# EasyEDA Pro project OpenHaldexC6-V1.1_2026-01-01.epro, board Haldex C6 V1.0
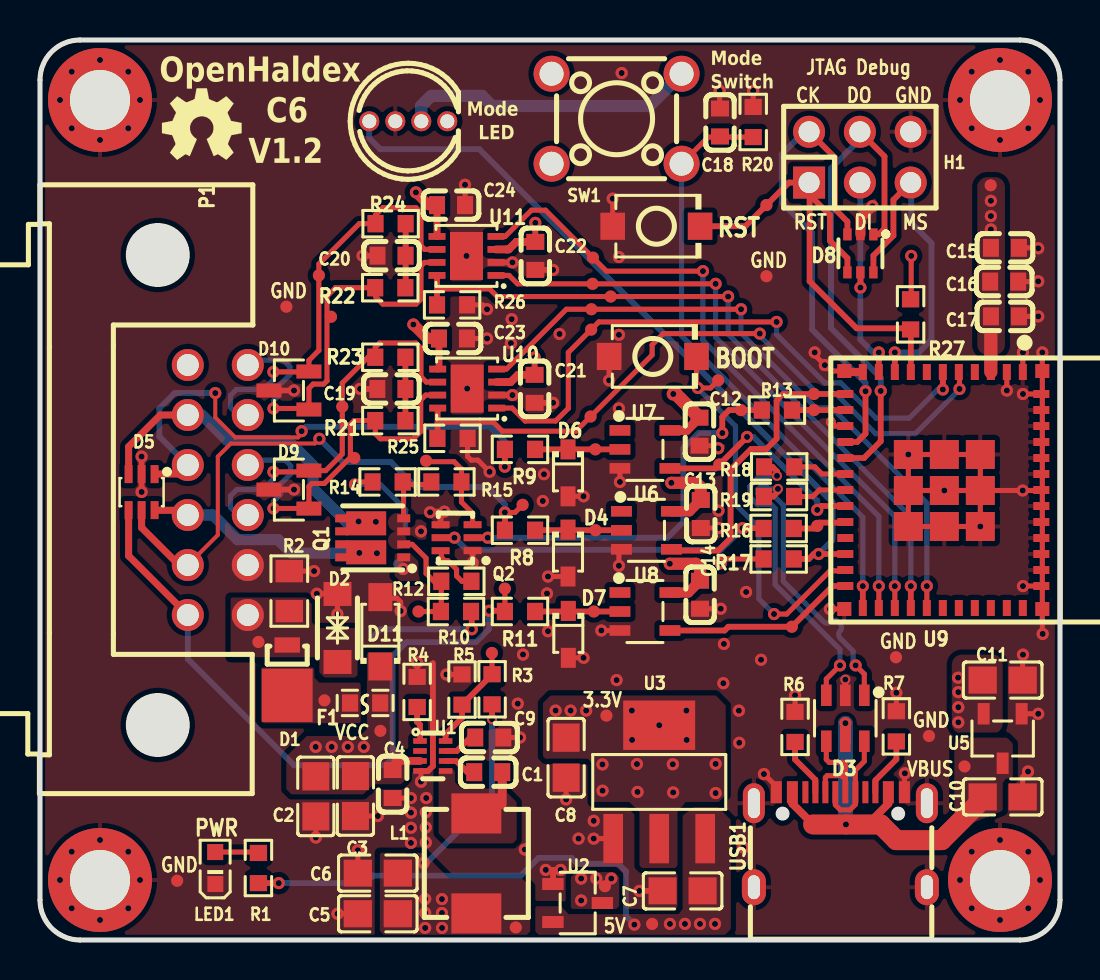
[diagram p3: board, top side]
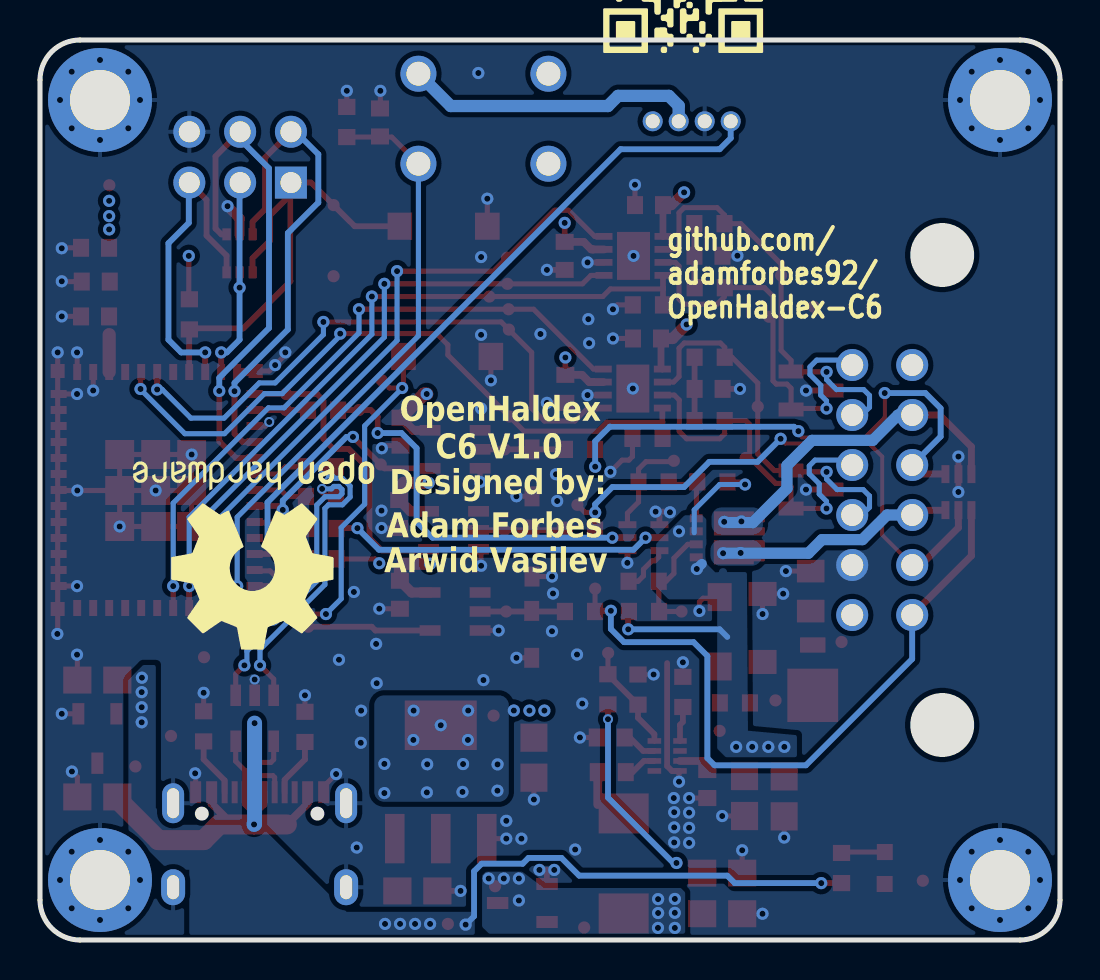
[diagram p4: board, bottom side, seen from below]

Outline 51 x 45 mm; copper layers: Top Layer, PWR, GND, Bottom Layer. Coordinates in mm from the lower left corner of the outline.
Outline path: 0,43 0,2 arc(0.59,0.59) 2,0 49,0 arc(50.41,0.59) 51,2 51,43 arc(50.41,44.41) 49,45 2,45 arc(0.59,44.41) 0,43
Stack: Top Layer 0.035mm Outer layer thickness 1oz / Dielectric1 0.2104mm 7628 RC49% 8.6mil / PWR 0.0152mm Inner layer thickness / Dielectric2 1.065mm 1.1mm H/HOZ Copper / GND 0.0152mm Inner layer thickness / Dielectric3 0.2104mm 7628 RC49% 8.6mil / Bottom Layer 0.035mm Outer layer thickness 1oz

## Design rules (mm)
net USB_D-: DP5
net USB_D+: DP5
net CHASSIS_CANL: DP1
net CHASSIS_CANH: DP1
net HALDEX_CANL: DP2
net HALDEX_CANH: DP2
net ESP_USB_D-: DP7
net ESP_USB_D+: DP7
net D-: DP6
net D+: DP6
template: Custom Config
spacing copperThickness1oz (default): track to track 0.102, other pairs 0.152 to 0.3
spacing copperThickness2oz: track to track 0.203, other pairs 0.152 to 0.3
track width copperThickness1oz: min 0.127, default 0.254, max 2.54
track width copperThickness2oz (default): min 0.127, default 0.254, max 2.54
differential pair differentialPair (default): width min 0.127, default 0.254, max 2.54; gap min 0.152, default 0.152
via viaSize (default): diameter min 0.5, default 0.61, max 10; hole min 0.3, default 0.305, max 6.3

## Placement (name value [footprint] x y rotation side)
C1  100nF  [C0603]  22.41 8.39 180 top
C2  22uF  [C0805]  13.79 7.18 270 top
C3  22uF  [C0805]  15.77 7.2 270 top
C4  100nF  [C0603]  17.64 7.8 90 top
C5  47uF  [C0805]  16.89 1.31 0 top
C6  47uF  [C0805]  16.89 3.34 0 top
C7  22uF  [C0805]  32.13 2.45 0 top
C8  47uF  [C0805]  26.31 9.12 90 top
C9  33nF  [C0603]  22.46 10.13 180 top
C10  22uF  [C0805]  48.13 7.15 0 top
C11  22uF  [C0805]  48.13 13 0 top
C12  100nF  [C0603]  32.97 25.42 90 top
C13  100nF  [C0603]  33.04 21.3 90 top
C14  100nF  [C0603]  33 17.26 90 top
C15  4.7uF  [C0603]  48.25 34.61 0 top
C16  2.2uF  [C0603]  48.21 32.92 0 top
C17  100nF  [C0603]  48.25 31.18 0 top
C18  1uF  [C0603]  34 40.88 90 top
C19  2.2nF  [C0603]  17.57 27.55 0 top
C20  2.2nF  [C0603]  17.58 34.21 0 top
C21  100nF  [C0603]  24.73 27.56 90 top
C22  100nF  [C0603]  24.76 34.2 90 top
C23  1uF  [C0603]  20.65 30.08 0 top
C24  1uF  [C0603]  20.55 36.75 0 top
D1  SS3P3-M3/84A  [DO-220AA_L3.4-W2.0-LS3.9-RD]  12.36 13.49 90 top
D2  SMF24CA  [SOD-123FL_L2.8-W1.8-LS3.7-BI]  14.87 15.6 270 top
D3  USBLC6-2SC6  [SOT-23-6_L2.9-W1.6-P0.95-LS2.8-BL]  40.27 11.09 180 top
D4  BZT52C4V7S  [SOD-323_L1.8-W1.3-LS2.5-RD]  26.4 19.35 270 top
D5  SMF12CT1G  [SOT-363_L2.0-W1.3-P0.65-LS2.1-BR]  5.08 22.39 90 top
D6  BZT52C4V7S  [SOD-323_L1.8-W1.3-LS2.5-RD]  26.4 23.36 270 top
D7  BZT52C4V7S  [SOD-323_L1.8-W1.3-LS2.5-RD]  26.42 15.28 270 top
D8  SMF05C  [SC-70-6_L2.0-W1.3-P0.65-LS2.1-BR]  41.02 34.33 90 top
D9  PESD2CAN  [SOT-23-3_L2.9-W1.3-P1.90-LS2.4-BR]  12.45 22.52 0 top
D10  PESD2CAN  [SOT-23-3_L2.9-W1.3-P1.90-LS2.4-BR]  12.45 27.47 0 top
D11  SMF24A  [SOD-123FL_L2.7-W1.8-LS3.8-RD]  17.02 15.41 90 top
F1  0467001.NRHF  [F0603]  16.26 11.85 0 top
H1  2.54-2*3  [HDR-TH_6P-P2.54-V-R2-C3-S2.54_A2541WV-2X3P]  40.99 39.14 0 top
L1  3.3uH  [IND-SMD_L5.4-W5.2_RS0530]  21.82 3.83 270 top
LED1  XL-1608UGC-04  [LED0603-RD_GREEN]  8.76 3.6 90 top
LED2  WS2812D-F5  [LED-TH_4P-BD5.8-P1.30]  18.41 40.94 0 top
NOREF  -  [Pad_e3430]  27.56 30.52 0 top
NOREF#2  -  [Pad_e6813]  38.86 20.7 0 top
NOREF#3  -  [Pad_e6564]  24.13 21.76 0 top
NOREF#4  -  [Pad_e7535]  47.53 37.74 0 top
NOREF#5  -  [Pad_e6325]  23.24 17.57 0 top
NOREF#6  -  [Pad_e5614]  19.31 23.96 0 top
NOREF#7  -  [Pad_e190]  48 42 90 top
NOREF#8  -  [Pad_e3424]  27.57 31.54 0 top
NOREF#9  -  [Pad_e4156]  27.77 24.53 0 top
NOREF#10  -  [Pad_e7773]  22.59 14.35 0 top
NOREF#11  -  [Pad_e4150]  27.78 20.49 0 top
NOREF#12  -  [Pad_e188]  3 42 90 top
NOREF#13  -  [Pad_e3909]  27.53 26.17 0 top
NOREF#14  -  [Pad_e835]  10.92 14.9 0 top
NOREF#15  -  [Pad_e2628]  23.79 0.63 0 top
NOREF#16  -  [Pad_e5126]  15.11 26.67 0 top
NOREF#17  -  [Pad_e833]  14.22 11.98 0 top
NOREF#18  -  [Pad_e5133]  15.71 24.1 0 top
NOREF#19  -  [Pad_e2329]  44.45 10.2 0 top
NOREF#20  -  [Pad_e3406]  27.65 34.12 0 top
NOREF#21  -  [Pad_e6811]  33.96 23.78 0 top
NOREF#22  -  [Pad_e5375]  14.55 31.16 0 top
NOREF#23  -  [Pad_e830]  28.25 2.69 0 top
NOREF#24  -  [Pad_e6815]  37.59 15.66 0 top
NOREF#25  -  [Pad_e832]  17.02 10.46 0 top
NOREF#26  -  [Pad_e191]  48 3 90 top
NOREF#27  -  [Pad_e2333]  42.8 14.14 0 top
NOREF#28  -  [Pad_e826]  46.23 8.68 0 top
NOREF#29  -  [Pad_e3418]  28.53 32.17 0 top
NOREF#30  -  [Pad_e3412]  27.63 32.81 0 top
NOREF#31  -  [Pad_e2331]  12.32 31.67 0 top
NOREF#32  -  [Pad_e6804]  38.7 26.5 0 top
NOREF#33  -  [Pad_e5852]  18.92 16.42 0 top
NOREF#34  -  [Pad_e6819]  33.91 27.98 0 top
NOREF#35  -  [Pad_e2340]  6.86 2.96 0 top
NOREF#36  -  [Pad_e2338]  36.32 33.19 0 top
NOREF#37  -  [Pad_e875]  28.32 11.22 0 top
NOREF#38  -  [Pad_e5369]  13.94 33.23 0 top
NOREF#39  -  [Pad_e837]  30.61 0.8 0 top
NOREF#40  -  [Pad_e4162]  27.69 16.42 0 top
NOREF#41  -  [Pad_e8960]  35.05 26.5 0 top
NOREF#42  -  [Pad_e192]  3 3 90 top
NOREF#43  -  [Pad_e6801]  38.69 27.3 0 top
NOREF#44  -  [Pad_e7058]  36.32 36.75 0 top
P1  MX23A12NF1  [COON-TH_MX23A12NF1]  8.89 22.5 270 top
Q1  AGM30P14MBP  [DFN-8_L3.2-W3.1-P0.65-LS3.4-BL-1]  16.64 20.11 90 top
Q2  2N7002DW  [SOT-363-6_L2.0-W1.3-P0.65-LS2.1-BL]  20.83 20.11 90 top
R1  1kΩ  [R0603]  10.92 3.6 270 top
R2  280pF@1MHz  [R0805]  12.47 17.45 270 top
R3  52.3kΩ  [R0603]  22.6 12.53 270 top
R4  20kΩ  [R0603]  18.86 12.4 270 top
R5  10kΩ  [R0603]  21.1 12.52 270 top
R6  5.1kΩ  [R0603]  37.75 10.65 270 top
R7  5.1kΩ  [R0603]  42.82 10.68 270 top
R8  1kΩ  [R0603]  24 20.49 180 top
R9  1kΩ  [R0603]  24 24.53 180 top
R10  20kΩ  [R0603]  20.8 16.42 0 top
R11  1kΩ  [R0603]  24 16.42 180 top
R12  10kΩ  [R0603]  20.82 17.94 180 top
R13  1kΩ  [R0603]  36.85 26.5 180 top
R14  20kΩ  [R0603]  17.38 22.9 180 top
R15  10kΩ  [R0603]  20.32 22.9 0 top
R16  1kΩ  [R0603]  36.93 20.58 180 top
R17  10kΩ  [R0603]  36.93 19.05 180 top
R18  33Ω  [R0603]  36.96 23.66 0 top
R19  33Ω  [R0603]  36.95 22.17 0 top
R20  10kΩ  [R0603]  35.66 40.9 270 top
R21  60.4Ω  [R0603]  17.52 25.97 180 top
R22  60.4Ω  [R0603]  17.51 32.61 180 top
R23  60.4Ω  [R0603]  17.52 29.14 0 top
R24  60.4Ω  [R0603]  17.53 35.82 0 top
R25  10kΩ  [R0603]  20.62 25.08 0 top
R26  10kΩ  [R0603]  20.61 31.76 0 top
R27  10kΩ  [R0603]  43.53 31.28 90 top
SW1  TS-1002-07026  [SW-TH_4P-L6.0-W6.0-P4.50-LS6.5]  28.83 41.06 0 top
SW2  TS-1088-AR02016  [SW-SMD_L3.9-W3.0-P4.45]  30.82 35.69 0 top
SW3  TS-1088-AR02016  [SW-SMD_L3.9-W3.0-P4.45]  30.64 29.18 0 top
U1  TPS62933DRLR  [SOT-583-8_L2.1-W1.2-P0.50-LS1.6-BR]  19.64 9.2 180 top
U2  CH213K  [SOT-23-3_L2.9-W1.6-P1.90-LS2.8-BR]  26.88 1.85 180 top
U3  AMS1117-3.3  [SOT-223-4_L6.5-W3.5-P2.30-LS7.0-BR]  30.96 7.9 270 top
U5  CH213K  [SOT-23-3_L2.9-W1.6-P1.90-LS2.8-BR]  48.13 10.08 90 top
U6  SN74LVC1G17DBVR  [SOT-23-5_L3.0-W1.5-P0.95-LS2.8-BL]  30.32 20.48 270 top
U7  SN74LVC1G17DBVR  [SOT-23-5_L3.0-W1.5-P0.95-LS2.8-BL]  30.25 24.53 270 top
U8  SN74LVC1G17DBVR  [SOT-23-5_L3.0-W1.5-P0.95-LS2.8-BL]  30.25 16.42 270 top
U9  ESP32-C6-MINI-1-N4  [WIFIM-SMD_61P-L16.6-W13.2-P0.80-ESP32-C6-MINI-1-N4]  45.17 22.5 270 top
U10  TCAN1044VDRBRQ1  [VSON-8_L3.0-W3.0-P0.65-BR-EP]  21.36 27.57 0 top
U11  TCAN1044VDRBRQ1  [VSON-8_L3.0-W3.0-P0.65-BR-EP]  21.32 34.2 0 top
USB1  TYPE-C 16PIN 2MD(073)  [USB-C-SMD_TYPE-C-6PIN-2MD-073]  40.02 5.01 0 top

## Footprints (pads in the part's own frame, mm; a bottom-side part is the same pattern mirrored in y, then rotated)
C0603
  rect 0.8x0.9 smd: 1(-0.7,0) 2(0.7,0)
C0805
  rect 1.41x1.35 smd: 1(-1,0) 2(1,0)
COON-TH_MX23A12NF1
  round 1.6 hole 1.1: 1(6.25,1.5) 2(3.75,1.5) 3(1.25,1.5) 4(-1.25,1.5) 5(-3.75,1.5) 6(-6.25,1.5) 7(6.25,-1.5) 8(3.75,-1.5) 9(1.25,-1.5) 10(-1.25,-1.5) 11(-3.75,-1.5) 12(-6.25,-1.5)
DFN-8_L3.2-W3.1-P0.65-LS3.4-BL-1
  rect 0.4x0.65 smd: 1(-0.975,-1.55) 2(-0.325,-1.55) 3(0.325,-1.55) 4(0.975,-1.55) 5(0.975,1.55) 6(0.325,1.55) 7(-0.325,1.55) 8(-0.975,1.55)
  rect 1.2x2 smd: 6(0.725,0.329) 8(-0.725,0.326)
DO-220AA_L3.4-W2.0-LS3.9-RD
  rect 2.67x2.54 smd: 1(-1.258,0)
  rect 0.762x1.27 smd: 2(1.258,0)
F0603
  rect 0.806x0.864 smd: 1(-0.753,0) 2(0.753,0)
HDR-TH_6P-P2.54-V-R2-C3-S2.54_A2541WV-2X3P
  rect 1.6x1.6 hole 1.05: 1(-2.54,-1.27)
  round 1.6 hole 1.05: 2(-2.54,1.27) 3(0,-1.27) 4(0,1.27) 5(2.54,-1.27) 6(2.54,1.27)
IND-SMD_L5.4-W5.2_RS0530
  rect 2x2.5 smd: 1(-2.5,0) 2(2.5,0)
LED0603-RD_GREEN
  rect 0.8x0.8 smd: 1(-0.799,-0.004) 2(0.799,0.004)
LED-TH_4P-BD5.8-P1.30
  round 1 hole 0.7: 1(1.95,0) 2(0.65,0) 3(-0.65,0) 4(-1.95,0)
Pad_e188
  round 5.2 hole 3: 1(0,0)
Pad_e190
  round 5.2 hole 3: 1(0,0)
Pad_e191
  round 5.2 hole 3: 1(0,0)
Pad_e192
  round 5.2 hole 3: 1(0,0)
Pad_e826
  round 0.61 smd: TP1(0,0)
Pad_e830
  round 0.61 smd: TP3(0,0)
Pad_e832
  round 0.61 smd: TP4(0,0)
Pad_e833
  round 0.61 smd: TP5(0,0)
Pad_e835
  round 0.61 smd: TP6(0,0)
Pad_e837
  round 0.61 smd: TP7(0,0)
Pad_e875
  round 0.61 smd: TP8(0,0)
Pad_e2329
  round 0.61 smd: TP1(0,0)
Pad_e2331
  round 0.61 smd: TP1(0,0)
Pad_e2333
  round 0.61 smd: TP1(0,0)
Pad_e2338
  round 0.61 smd: TP1(0,0)
Pad_e2340
  round 0.61 smd: TP1(0,0)
Pad_e2628
  round 0.61 smd: TP7(0,0)
Pad_e3406
  round 0.61 smd: TP1(0,0)
Pad_e3412
  round 0.61 smd: TP2(0,0)
Pad_e3418
  round 0.61 smd: TP3(0,0)
Pad_e3424
  round 0.61 smd: TP4(0,0)
Pad_e3430
  round 0.61 smd: TP5(0,0)
Pad_e3909
  round 0.61 smd: TP6(0,0)
Pad_e4150
  round 0.61 smd: TP7(0,0)
Pad_e4156
  round 0.61 smd: TP8(0,0)
Pad_e4162
  round 0.61 smd: TP9(0,0)
Pad_e5126
  round 0.61 smd: TP11(0,0)
Pad_e5133
  round 0.61 smd: TP12(0,0)
Pad_e5369
  round 0.61 smd: TP13(0,0)
Pad_e5375
  round 0.61 smd: TP14(0,0)
Pad_e5614
  round 0.61 smd: TP15(0,0)
Pad_e5852
  round 0.61 smd: TP16(0,0)
Pad_e6325
  round 0.61 smd: TP17(0,0)
Pad_e6564
  round 0.61 smd: TP18(0,0)
Pad_e6801
  round 0.61 smd: TP19(0,0)
Pad_e6804
  round 0.61 smd: TP20(0,0)
Pad_e6811
  round 0.61 smd: TP21(0,0)
Pad_e6813
  round 0.61 smd: TP22(0,0)
Pad_e6815
  round 0.61 smd: TP23(0,0)
Pad_e6819
  round 0.61 smd: TP24(0,0)
Pad_e7058
  round 0.61 smd: TP25(0,0)
Pad_e7535
  round 0.61 smd: TP26(0,0)
Pad_e7773
  round 0.61 smd: TP27(0,0)
Pad_e8960
  round 0.61 smd: TP28(0,0)
R0603
  rect 0.806x0.864 smd: 1(-0.753,0) 2(0.753,0)
R0805
  rect 1.133x1.377 smd: 1(-1,0) 2(1,0)
SC-70-6_L2.0-W1.3-P0.65-LS2.1-BR
  rect 0.6x0.42 smd: 1(0.95,-0.65) 2(0.95,0) 3(0.95,0.65) 4(-0.95,0.65) 5(-0.95,0) 6(-0.95,-0.65)
SOD-123FL_L2.7-W1.8-LS3.8-RD
  rect 1.4x1.2 smd: 1(-1.735,0) 2(1.735,0)
SOD-123FL_L2.8-W1.8-LS3.7-BI
  rect 1.2x1.4 smd: 1(-1.7,0) 2(1.7,0)
SOD-323_L1.8-W1.3-LS2.5-RD
  rect 1x0.75 smd: 1(-1.173,0) 2(1.173,0)
SOT-23-3_L2.9-W1.3-P1.90-LS2.4-BR
  rect 1.25x0.7 smd: 1(1,-0.95) 2(1,0.95) 3(-1,0)
SOT-23-3_L2.9-W1.6-P1.90-LS2.8-BR
  rect 1.07x0.6 smd: 1(1.235,-0.95) 2(1.235,0.95) 3(-1.235,0)
SOT-23-5_L3.0-W1.5-P0.95-LS2.8-BL
  rect 0.532x1.045 smd: 1(-0.95,-1.25) 2(0,-1.25) 3(0.95,-1.25) 4(0.95,1.25) 5(-0.95,1.25)
SOT-23-6_L2.9-W1.6-P0.95-LS2.8-BL
  rect 0.532x1.072 smd: 1(-0.95,-1.149) 2(0,-1.149) 3(0.95,-1.149) 4(0.95,1.149) 5(0,1.149) 6(-0.95,1.149)
SOT-223-4_L6.5-W3.5-P2.30-LS7.0-BR
  rect 2.47x0.98 smd: 1(2.835,-2.3) 2(2.835,0) 3(2.835,2.3)
  rect 2.47x3.6 smd: 4(-2.835,0)
SOT-363-6_L2.0-W1.3-P0.65-LS2.1-BL
  rect 0.35x0.9 smd: 1(-0.65,-0.8) 2(0,-0.8) 3(0.65,-0.8) 4(0.65,0.8) 5(0,0.8) 6(-0.65,0.8)
SOT-363_L2.0-W1.3-P0.65-LS2.1-BR
  rect 0.9x0.4 smd: 1(0.9,-0.65) 2(0.9,0) 3(0.9,0.65) 4(-0.9,0.65) 5(-0.9,0) 6(-0.9,-0.65)
SOT-583-8_L2.1-W1.2-P0.50-LS1.6-BR
  rect 0.68x0.28 smd: 1(0.64,-0.75) 2(0.64,-0.25) 3(0.64,0.25) 4(0.64,0.75) 5(-0.64,0.75) 6(-0.64,0.25) 7(-0.64,-0.25) 8(-0.64,-0.75)
SW-SMD_L3.9-W3.0-P4.45
  rect 1.23x1.36 smd: 1(-2.185,0) 2(2.185,0)
SW-TH_4P-L6.0-W6.0-P4.50-LS6.5
  round 1.8 hole 1.2: 1(-3.25,2.25) 2(3.25,2.25) 3(-3.25,-2.25) 4(3.25,-2.25)
USB-C-SMD_TYPE-C-6PIN-2MD-073
  rect 0.55x1.1 smd: 1(-3.2,2.375) 2(-2.4,2.375) 11(2.4,2.375) 12(3.2,2.375)
  rect 0.3x1.1 smd: 3(-1.75,2.375) 4(-1.25,2.375) 5(-0.75,2.375) 6(-0.25,2.375) 7(0.25,2.375) 8(0.75,2.375) 9(1.25,2.375) 10(1.75,2.375)
  oval 1.1x2 hole 0.6x1.5: 13(-4.325,1.825) 14(4.325,1.825)
  oval 1.2x1.8 hole 0.6x1.2: 13(-4.325,-2.375) 14(4.325,-2.375)
VSON-8_L3.0-W3.0-P0.65-BR-EP
  rect 0.85x0.34 smd: 1(1.476,-0.976) 2(1.476,-0.325) 3(1.476,0.325) 4(1.476,0.976) 5(-1.476,0.976) 6(-1.476,0.325) 7(-1.476,-0.325) 8(-1.476,-0.976)
  rect 1.65x2.4 smd: 9(0,0)
WIFIM-SMD_61P-L16.6-W13.2-P0.80-ESP32-C6-MINI-1-N4
  rect 0.8x0.4 smd: 1(-5.9,3.975) 2(-5.9,3.175) 3(-5.9,2.375) 4(-5.9,1.575) 5(-5.9,0.775) 6(-5.9,-0.025) 7(-5.9,-0.825) 8(-5.9,-1.625) 9(-5.9,-2.425) 10(-5.9,-3.225) 11(-5.9,-4.025) 25(5.9,-4.025) 26(5.9,-3.225) 27(5.9,-2.425) 28(5.9,-1.625) 29(5.9,-0.825) 30(5.9,-0.025) 31(5.9,0.775) 32(5.9,1.575) 33(5.9,2.375) 34(5.9,3.175) 35(5.9,3.975)
  rect 0.4x0.8 smd: 12(-4.8,-4.9) 13(-4,-4.9) 14(-3.2,-4.9) 15(-2.4,-4.9) 16(-1.6,-4.9) 17(-0.8,-4.9) 18(0,-4.9) 19(0.8,-4.9) 20(1.6,-4.9) 21(2.4,-4.9) 22(3.2,-4.9) 23(4,-4.9) 24(4.8,-4.9) 36(4.8,4.9) 37(4,4.9) 38(3.2,4.9) 39(2.4,4.9) 40(1.6,4.9) 41(0.8,4.9) 42(0,4.9) 43(-0.8,4.9) 44(-1.6,4.9) 45(-2.4,4.9) 46(-3.2,4.9) 47(-4,4.9) 48(-4.8,4.9)
  rect 1.45x1.45 smd: 49(-1.775,1.85) 49(-1.775,0.05) 49(-1.775,-1.75) 49(0.025,1.85) 49(0.025,0.05) 49(0.025,-1.75) 49(1.825,1.85) 49(1.825,0.05) 49(1.825,-1.75)
  rect 0.7x0.7 smd: 50(5.95,4.95) 51(5.95,-4.95) 52(-5.95,-4.95) 53(-5.95,4.95)

## Nets
+3.3V: C8.2 C12.2 C13.2 C14.2 C15.1 C16.1 C17.1 C23.1 C24.1 LED2.2 NOREF#4.TP26 NOREF#37.TP8 R17.2 R27.2 SW1.2 U3.2 U3.4 U6.5 U7.5 U8.5 U9.3 U10.5 U11.5
+5V: C7.2 C11.1 C21.2 C22.2 NOREF#39.TP7 R1.2 U2.2 U3.3 U5.2 U10.3 U11.3
GND: C2.2 C3.2 C4.1 C5.1 C6.1 C7.1 C8.1 C9.1 C10.2 C11.2 C12.1 C13.1 C14.1 C15.2 C16.2 C17.2 C18.2 C19.1 C20.1 C21.1 C22.1 C23.2 C24.2 D2.1 D3.2 D4.2 D5.2 D6.2 D7.2 D8.2 D9.3 D10.3 D11.2 H1.6 LED1.1 LED2.3 NOREF#7.1 NOREF#12.1 NOREF#19.TP1 NOREF#26.1 NOREF#27.TP1 NOREF#31.TP1 NOREF#35.TP1 NOREF#36.TP1 NOREF#42.1 P1.2 Q2.1 Q2.4 R2.1 R4.1 R5.1 R6.1 R7.1 R20.1 R25.2 R26.2 SW2.1 SW3.1 U1.4 U2.1 U3.1 U5.1 U6.3 U7.3 U8.3 U9.1 U9.2 U9.11 U9.14 U9.36 U9.37 U9.38 U9.39 U9.40 U9.41 U9.42 U9.43 U9.44 U9.45 U9.46 U9.47 U9.48 U9.49 U9.50 U9.51 U9.52 U9.53 U10.2 U10.9 U11.2 U11.9 USB1.1 USB1.12 USB1.13 USB1.14
VBAT: D1.2 D2.2 NOREF#14.TP6 P1.1 R2.2
VBAT_UF: D1.1 F1.1 NOREF#17.TP5
VBUS: C10.1 D3.5 NOREF#28.TP1 U5.3 USB1.2 USB1.11
VCC: C2.1 C3.1 C4.2 D11.1 F1.2 NOREF#25.TP4 Q1.1 Q1.3 R10.2 R14.2 U1.3
BOOT: NOREF#34.TP24 SW3.2 U9.23
BRAKE_IN: D5.5 NOREF#3.TP18 P1.8 R8.2
BRAKE_OUT: D5.6 P1.9 Q1.7 Q1.8
BST: C1.2 U1.6
BUCK_OUT: C5.2 C6.2 L1.2 NOREF#15.TP7 NOREF#23.TP3 R3.2 U2.3
CAN0_RX: NOREF#8.TP4 U9.29 U10.4
CAN0_STANDBY: NOREF#13.TP6 R25.1 U9.5 U10.8
CAN0_TX: NOREF.TP5 U9.6 U10.1
CAN1_RX: NOREF#20.TP1 U9.26 U11.4
CAN1_STANDBY: NOREF#29.TP3 R26.1 U9.28 U11.8
CAN1_TX: NOREF#30.TP2 U9.27 U11.1
CC1: R6.2 USB1.4
CC2: R7.2 USB1.10
CHASSIS_CANH: D9.1 NOREF#18.TP12 P1.4 R21.2 U10.7
CHASSIS_CANL: D9.2 NOREF#16.TP11 P1.3 R23.1 U10.6
D+: R19.2 U9.18
D-: R18.2 U9.17
EN_TPS: U1.2
ESP_BRAKE_IN: NOREF#43.TP19 U6.4 U9.12
ESP_BRAKE_OUT: NOREF#32.TP20 R13.1 U9.13
ESP_BRAKE_TRANS: NOREF#41.TP28 Q2.2 R13.2
ESP_HB_IN: NOREF#21.TP21 U7.4 U9.19
ESP_HB_OUT: NOREF#2.TP22 R16.1 U9.20
ESP_HB_TRANS: Q2.5 R16.2
ESP_SWITCH_MODE_EXT: NOREF#24.TP23 U8.4 U9.24
ESP_USB_D+: D3.1 R19.1
ESP_USB_D-: D3.3 R18.1
FB: NOREF#10.TP27 R3.1 R5.2 U1.8
HALDEX_CANH: D10.1 NOREF#22.TP14 P1.6 R22.2 U11.7
HALDEX_CANL: D10.2 NOREF#38.TP13 P1.5 R24.1 U11.6
HB_IN: D5.1 P1.10 R9.2
HB_OUT: D5.3 P1.11 Q1.5 Q1.6
MTCK: D8.3 H1.2 U9.15
MTDI: D8.5 H1.3 U9.10
MTDO: D8.1 H1.4 U9.16
MTMS: D8.6 H1.5 U9.9
RESET: D8.4 H1.1 NOREF#44.TP25 R27.1 SW2.2 U9.8
RGB_LED: LED2.4 R17.1 U9.22
RT: R4.2 U1.1
SS: C9.2 U1.7
SW: C1.1 L1.1 U1.5
SWITCH_MODE: C18.1 R20.2 SW1.4 U9.25
SWITCH_MODE_EXT: D5.4 NOREF#5.TP17 P1.7 R11.2
USB_D+: D3.6 USB1.6 USB1.8
USB_D-: D3.4 USB1.5 USB1.7
$2N1005: LED1.2 R1.1
$3N1132: D6.1 NOREF#9.TP8 R9.1 U7.2
$3N1135: D4.1 NOREF#11.TP7 R8.1 U6.2
$3N1142: D7.1 NOREF#40.TP9 R11.1 U8.2
$3N1660: Q1.4 R14.1 R15.1
$3N2481: NOREF#6.TP15 Q2.3 R15.2
$3N2546: Q2.6 R12.1
$3N2561: NOREF#33.TP16 Q1.2 R10.1 R12.2
$4N2100: C20.2 R22.1 R24.2
$4N2133: C19.2 R21.1 R23.2

Pads without a net: LED2 1; P1 12; SW1 1 3; U6 1; U7 1; U8 1; U9 4 7 21 30 31 32 33 34 35; USB1 3 9

## Via types
v1: diameter 0.61, hole 0.305, Top Layer to Bottom Layer, 240 vias
v2: diameter 0.5, hole 0.305, Top Layer to Bottom Layer, 5 vias

## Routing (per net, layer and track width the routed paths; a pad name or vN(x,y) marks a point on that pad's centre or on a via; arc(x,y) is an arc through that point)
+3.3V: length 44.3
  Top Layer w0.254: R17.2 34.25,19.05 v1(34.04,18.84) ; v1(43.56,34.2) 43.56,32.06 43.53,32.03
  Top Layer w0.341: C23.1 19.95,28.61 19.88,28.55 ; U11.5 19.85,35.18 C24.1
  Top Layer w0.457: C12.2 32.34,25.48 31.5,25.48
  Top Layer w0.508: C24.1 19.43,36.75 v1(18.8,37.38) ; C14.2 32.41,17.38 U8.5 ; U6.5 32.47,21.43 C13.2
  Top Layer w0.559: C23.1 19.37,30.08 v1(18.67,30.78)
  Top Layer w0.61: C14.2 33,18.6 32.79,18.81 v1(31.49,18.81) ; C13.2 33.04,22.63 32.81,22.86 v1(31.57,22.86)
  Top Layer w0.66: U9.3 47.54,30.27 ; C12.2 31.79,27.3 v1(31.66,27.3)
  PWR w0.61: v1(34.04,18.84) 31.5,18.84 30.35,17.69
  PWR w1.016: LED2.2 19.06,39.41
  Bottom Layer w0.61: LED2.2 19.06,41.71 19.56,42.21 22.1,42.21 22.61,41.7 30.46,41.7 SW1.2
  vias: v1(25.78,11.47) v1(26.53,11.47) v1(27.31,11.47) v1(28.12,8.78) v1(28.13,7.47) v1(29.59,11.47) v1(29.6,10) v1(29.85,8.8) v1(29.88,7.4) v1(30.96,10.74) v1(31.64,8.79) v1(31.66,7.38) v1(32.32,11.47) v1(32.33,10) v1(33.78,8.81) v1(33.78,7.35) v1(47.54,36.96) v1(47.54,36.19) v1(47.54,35.53)
+5V: length 73.3
  Top Layer w0.29: R1.2 v1(11.94,2.84) ; C21.2 v1(24.73,29.12) ; C22.2 v1(24.76,35.86)
  Top Layer w0.392: U11.3 23.35,34.53 23.35,34.53 23.44,34.53 23.81,34.91 C22.2 ; C21.2 23.9,28.26 23.54,27.9 23.35,27.9 23.35,27.9 U10.3
  PWR w0.66: v1(33.75,0.8) 33.75,3.62 33.09,4.28 26.6,4.28 24.85,6.04 24.85,13.46 27.97,16.58 27.97,25.88 24.64,29.21 24.64,35.73 v1(24.76,35.86)
  Bottom Layer w0.29: v1(29.72,0.77) 29.3,1.19 29.3,3.44 28.92,3.82 26.86,3.82 26.57,4.11 24.93,4.11 24.04,3.22 16.64,3.22 16.26,2.84 v1(11.94,2.84)
  vias: v1(31.5,0.8) v1(32.25,0.8) v1(33,0.8) v1(45.91,13.11) v1(45.92,12.39) v1(45.92,11.64) v1(45.92,10.88)
GND: length 108.2
  Top Layer w0.254: C8.1 v1(26.31,7.03) ; SW3.1 v1(28.46,27.98) ; 35.66,41.55 v1(35.66,42.46) ; C14.1 v1(34.04,16.56) ; R7.1 v1(42.82,12.36) ; 16.98,17.09 17.85,17.09 18.03,16.91 v1(18.03,16.45) ; U9.49 v1(49.13,22.47) 50.04,22.47 U9.42 ; U9.49 U9.49 U9.49 v1(43.42,24.28) U9.49 ; U9.49 v1(47.02,20.67) U9.49 U9.49 U9.49 ; U9.49 v1(45.22,22.47) U9.49 ; v1(19.05,7.92) 19.05,8.4 U1.4 ; U7.3 v1(29,22.9) ; R25.2 21.38,24.17 21.56,23.99 21.9,23.99 v1(22.48,23.41) ; D6.2 v1(27.18,22.19) ; C5.1 v1(14.88,1.31) ; C16.2 49.9,32.92 v1(49.91,32.94) ; v1(49.15,29.38) 49.14,29.37 U9.1 ; C10.2 49.13,8.15 v1(49.4,8.42) ; U9.2 v1(48.34,27.47) ; 40.27,25.7 39.74,25.7 v2(39.54,25.9) ; C11.2 49.13,14.25 v1(49.15,14.27) ; 21.36,31.76 22.13,31.76 v1(22.35,31.54) ; D7.2 v1(27.18,14.11) ; U9.51 v1(39.5,16.55) ; C24.2 v1(21.25,37.76) ; R4.1 v1(18.86,13.89) ; C15.2 49.89,34.61 v1(49.91,34.59) ; R2.1 v1(13.7,18.45) ; C4.1 v1(18.54,7.1) ; v1(50.12,29.38) U9.53 U9.50 50.12,15.32 v1(50.13,15.3) ; U8.3 v1(28.07,15.47) ; C3.2 v1(16.89,6.2) ; v1(28.94,18.71) 28.94,19.41 U6.3 ; R6.1 v1(37.75,12.23) ; SW2.1 v1(28.63,37.07) ; v1(49.15,17.69) 49.15,17.7 U9.36 ; v1(36.19,8.3) 36.82,7.67 USB1.1 ; v1(38.74,29.38) 38.74,29.25 v1(39.24,28.74) 39.54,28.45 U9.52 ; 33.98,41.65 v1(33.98,42.46) ; C13.1 v1(33.93,20.6) ; v1(43.24,8.33) 43.22,8.31 USB1.12 ; D4.2 v1(25.4,18.17) ; R5.1 v1(20.32,13.28) ; v1(33.91,24.59) 33.78,24.72 C12.1 ; U3.1 v1(27.69,5.07) ; v1(14.87,16.3) D2.1 14.86,17.31 v1(13.84,17.31) ; C2.2 v1(13.79,5.12) ; 23.16,10.13 v1(24,10.13) ; C23.2 v1(22.35,30.08) ; C17.2 v1(49.91,31.18) ; C6.1 v1(15.89,4.49) ; U5.1 v1(49.91,11.31) ; U9.48 v1(49.15,27.3)
  Top Layer w0.29: 25.65,3.5 25.65,2.81 U2.1 ; 25.65,3.5 v1(26.03,3.5) ; 25.65,3.5 v1(25.29,3.5) ; 24.65,33.5 v1(25.65,33.5) ; 11.7,22.52 v1(12.7,22.52) ; 21.63,19.47 21.63,18.97 ; U1.4 19.4,8.45 19.64,8.7 19.64,13.84 ; 11.7,27.47 v1(12.7,27.47) ; Q2.4 20.03,21.18 20.22,21.37 v1(20.22,21.42) 19.53,21.42 v1(19.5,21.39) ; 22.8,33.88 v1(23.62,33.88) ; D8.2 41.07,35.33 ; C7.1 v1(29.97,2.45) ; C19.1 v1(16,27.55) ; C21.1 v1(25.65,26.86) ; v1(5.08,24.17) D5.2 v1(5.08,22.4) ; C20.1 v1(16.13,34.21) ; U10.2 v1(23.62,27.25) ; 40.27,12.24 v2(40.27,13.02)
  Top Layer w0.406: U9.52 40.27,28.4 U9.11
  Top Layer w0.508: D8.2 41.02,36.09 v1(41.62,36.69)
  vias: v1(1,42) v1(1,3) v1(1.59,43.41) v1(1.59,40.59) v1(1.59,4.41) v1(1.59,1.59) v1(3,44) v1(3,40) v1(3,5) v1(3,1) v1(4.41,43.41) v1(4.41,40.59) v1(4.41,4.41) v1(4.41,1.59) v1(5,42) v1(5,3) v1(18.55,6.37) v1(18.55,5.61) v1(18.55,4.85) v1(19.31,7.1) v1(19.29,6.39) v1(19.29,5.63) v1(19.29,4.88) v1(21.32,34.2) v1(21.36,27.57) v1(21.63,18.86) v1(23.55,29.84) v1(23.58,31.04) v1(23.89,11.82) v1(24.15,14.27) v1(24.24,4.52) v1(25.14,21.95) v1(25.2,23.29) v1(25.35,17.33) v1(25.4,15.44) v1(25.98,30.3) v1(26.93,5.07) v1(27.69,5.96) v1(28.83,13) v1(28.95,34.15) v1(28.95,30.26) v1(28.95,26.58) v1(29.08,43.35) v1(33.93,21.47) v1(34.19,14.8) v1(34.17,12.84) v1(34.94,11.47) v1(34.96,9.86) v1(35.16,4.62) v1(35.31,17.4) v1(36.05,14.01) v1(46,42) v1(46,3) v1(46.59,43.41) v1(46.59,40.59) v1(46.59,4.41) v1(46.59,1.59) v1(48,44) v1(48,40) v1(48,5) v1(48,1) v1(49.41,43.41) v1(49.41,40.59) v1(49.41,4.41) v1(49.41,1.59) v1(50,42) v1(50,3)
VBUS: length 19.6
  Top Layer w0.392: USB1.11 42.42,6.82 41.57,5.97 ; 38.66,5.78 37.62,6.82 USB1.2
  Top Layer w0.544: v1(40.27,10.84) 40.27,9.94 D3.5
  Top Layer w1: C10.1 47.13,7.04 45.09,5 42.82,5 42.03,5.78 v1(40.3,5.78) 38.66,5.78
  Bottom Layer w0.747: v1(40.27,10.84) 40.27,5.81 v1(40.3,5.78)
VCC: length 12.7
  Top Layer w0.254: v1(15.75,22.78) 15.88,22.9 R14.2
  Top Layer w0.29: R10.2 21.59,16.39 v1(21.59,15.54)
  Top Layer w0.392: U1.3 17.78,8.95
  Bottom Layer w0.254: 18.29,20.36 18.29,21.5 17.02,22.78 v1(15.75,22.78)
  Bottom Layer w0.29: v1(21.59,15.54) 17.02,15.54 16.64,15.16
  Bottom Layer w0.5: v1(18.16,18.55) 17.91,18.81
  vias: v1(13.78,9.66) v1(14.58,9.66) v1(15.39,9.66) v1(16.19,9.66) v1(19.05,20.43)
BOOT: length 20.1
  Top Layer w0.254: 40.27,18.5 40.22,18.46 39.5,18.46 37.34,16.3 v1(36.7,16.3) ; SW3.2 32.83,27.67 v1(32.89,27.6) 33.53,27.6 NOREF#34.TP24
  Bottom Layer w0.254: v1(32.89,27.6) 32.89,27.58 34.77,25.7 34.77,21.79 35.94,20.62 35.94,17.06 v1(36.7,16.3)
BRAKE_IN: length 28.4
  Top Layer w0.2: v1(13.97,25.06) 13.74,24.83 9.54,24.83 8.89,24.17 8.89,20.25 P1.8
  Top Layer w0.254: NOREF#3.TP18 23.75,21.38 v1(23.24,21.38)
  Top Layer w0.29: v1(23.24,21.38) 23.25,21.37 R8.2
  Top Layer w0.35: P1.8 6.95,18.75 5.08,20.62 5.08,21.49
  Bottom Layer w0.29: v1(23.24,21.38) 23.24,21.79 22.38,22.65 18.8,22.65 17.54,23.91 15.12,23.91 v1(13.97,25.06)
BRAKE_OUT: length 12
  Top Layer w0.35: 5.73,21.49 7.15,21.49 P1.9
  Bottom Layer w0.559: P1.9 8.65,21.25 9.88,20.02 11.9,20.02 12.58,19.34 v1(16.85,19.34)
  vias: v1(15.97,19.35)
BST: length 1.7
  Top Layer w0.29: U1.6 20.81,8.95 21.37,8.39 C1.2
BUCK_OUT: length 9.4
  Top Layer w0.29: R3.2 22.6,11.22 22.6,11.21 v2(22.6,11.04)
  Bottom Layer w0.29: v1(19.18,3.85) 19.33,3.85 22.6,7.12 v2(22.6,11.04)
  vias: v1(19.26,2.05) v1(19.26,1.36) v1(19.26,0.6) v1(20.1,2.04) v1(20.1,1.35) v1(20.1,0.6) v1(27.06,3.07) v1(27.06,1.98) v1(27.81,3.07) v1(28.56,3.07)
CAN0_RX: length 32.7
  Top Layer w0.254: 22.83,28.55 23.33,28.55 26.32,31.54 NOREF#8.TP4 v1(35.05,31.54) ; U9.29 v1(44.34,17.69)
  Bottom Layer w0.254: v1(44.34,17.69) 44.34,21.85 39.58,26.61 38.8,26.61 35.05,30.35 v1(35.05,31.54)
CAN0_STANDBY: length 34
  Top Layer w0.254: U9.5 45.97,28.37 v1(45.97,27.55) ; v1(35.99,30.32) 31.17,30.32 30.61,29.76 30.61,29.25 NOREF#13.TP6 26.8,25.44 23.11,25.44 22.67,25.89 19.88,25.89
  Top Layer w0.29: U10.8 19.88,25.1 R25.1
  Bottom Layer w0.254: v1(35.99,30.32) 35.99,30.22 38.89,27.32 39.77,27.32 41.78,25.31 43.76,25.31 45.97,27.53 v1(45.97,27.55)
CAN0_TX: length 29.2
  Top Layer w0.254: U10.1 23.61,26.6 24.26,25.95 25.78,25.95 26.42,26.58 26.42,29.38 NOREF.TP5 27.94,30.9 v1(36.83,30.9)
  Bottom Layer w0.254: v1(36.83,30.9) 36.83,30.27 39.24,27.86 40.03,27.86 41.79,26.09 43.46,26.09 44.89,27.53 v1(45.14,27.53)
CAN1_RX: length 32.6
  Top Layer w0.254: U11.4 23.26,35.18 24.57,36.49 25.27,36.49 NOREF#20.TP1 28.32,33.44 v1(33.15,33.44) ; U9.26 v1(41.94,17.69)
  Bottom Layer w0.254: v1(41.94,17.69) 41.94,21.18 33.15,29.98 v1(33.15,33.44)
CAN1_STANDBY: length 35.6
  Top Layer w0.254: 19.85,32.57 19.86,32.55 22.48,32.55 22.86,32.17 NOREF#29.TP3 v1(34.41,32.17)
  Top Layer w0.29: U11.8 19.85,31.76 R26.1 ; U9.28 v1(43.54,17.69)
  Bottom Layer w0.254: v1(43.54,17.69) 43.54,21.15 34.41,30.29 v1(34.41,32.17)
CAN1_TX: length 31.1
  Top Layer w0.254: U11.1 23.46,33.23 23.88,32.81 NOREF#30.TP2 v1(33.78,32.81) ; U9.27 v1(42.74,17.69)
  Bottom Layer w0.254: v1(33.78,32.81) 33.78,30.14 42.74,21.18 v1(42.74,17.69)
CC1: length 2.9
  Top Layer w0.29: R6.2 37.75,9.03 38.77,8.01 USB1.4
CC2: length 3
  Top Layer w0.29: USB1.10 41.77,7.98 42.82,9.03 R7.2
CHASSIS_CANH: length 19.3
  Top Layer w0.254: 13.7,21.57 13.69,21.58 13.45,21.58 ; U10.7 19.29,27.25 19.04,27 19.04,25.43 18.67,25.06 17.02,25.06 16.76,25.31 R21.2 15.7,25.97 15.52,25.78 15.52,24.13 14.22,22.83 13.59,22.83 13.45,22.68 13.45,21.58 ; 13.45,21.58 v1(11.67,21.58) ; 13.45,21.58 D9.1
  Bottom Layer w0.254: P1.4 10.63,23.99 12.25,23.99 12.54,23.7 12.54,23.31 12.04,22.81 12.04,22.3 11.67,21.94 v1(11.67,21.58)
CHASSIS_CANL: length 19.3
  Top Layer w0.254: U10.6 19.32,27.9 19.05,28.17 19.05,29.59 18.79,29.85 16.98,29.85 16.76,29.63 R23.1 16.4,29.14 15.11,27.85 NOREF#16.TP11 15.11,24.3 14.28,23.47 D9.2 13.38,23.41 v1(11.67,23.41)
  Bottom Layer w0.254: P1.3 9.91,21.25 9.53,21.63 9.53,22.2 9.84,22.52 11.15,22.52 11.67,23.05 v1(11.67,23.41)
D+: length 2.7
  Top Layer w0.254: R19.2 38.64,22.17 38.97,22.5 40.27,22.5
D-: length 2.7
  Top Layer w0.254: 40.27,23.3 39.1,23.3 38.74,23.66 R18.2
ESP_BRAKE_IN: length 15.1
  Top Layer w0.29: 40.27,27.3 NOREF#43.TP19 37.15,27.3 36.9,27.05 36.9,27.03 36.83,26.97 36.83,25.06 36.32,24.55 35.56,24.55 34.53,23.52 34.53,20.09 33.91,19.47 31.63,19.47 U6.4
ESP_BRAKE_OUT: length 2.7
  Top Layer w0.29: 37.6,26.5 NOREF#32.TP20 40.26,26.5 40.27,26.5
ESP_BRAKE_TRANS: length 19.7
  Top Layer w0.29: R13.2 NOREF#41.TP28 34.45,26.5 34.12,26.16 v1(34.12,25.35) ; Q2.2 v1(22.39,20.11)
  Bottom Layer w0.29: v1(34.12,25.35) 32.93,25.35 32.17,24.59 32.17,20.91 31.38,20.11 v1(22.39,20.11)
ESP_HB_IN: length 11.3
  Top Layer w0.29: U7.4 33.78,23.58 v1(35.35,25.15) ; 40.27,21.7 39.06,21.7 v1(38.86,21.5)
  Bottom Layer w0.29: v1(35.35,25.15) 35.68,25.15 38.86,21.97 v1(38.86,21.5)
ESP_HB_OUT: length 2.7
  Top Layer w0.29: 40.27,20.9 40.24,20.87 38.99,20.87 38.69,20.58 R16.1
ESP_HB_TRANS: length 16.9
  Top Layer w0.29: Q2.5 v1(20.72,20.11) ; v1(35.13,20.59) 36.16,20.59 R16.2
  Bottom Layer w0.29: v1(35.13,20.59) 34.05,19.51 21.32,19.51 v1(20.72,20.11)
ESP_SWITCH_MODE_EXT: length 9.7
  Top Layer w0.29: U8.4 34.23,15.47 34.42,15.66 NOREF#24.TP23 39.63,17.7 40.27,17.7
ESP_USB_D+: length 15.5
  Top Layer w0.254: D3.1 41.22,13.3 v1(40.78,13.73)
  Top Layer w0.29: R19.1 36.65,22.17 36.9,22.42 v2(36.9,22.56)
  Bottom Layer w0.254: v2(36.9,22.56) 36.43,22.56 36.31,22.68 36.05,22.68 35.9,22.53 35.9,22.32 36.05,22.17 36.74,22.17 37.16,21.75 37.16,17.94 39.18,15.92 arc(39.37,15.84) 39.55,15.92 arc(39.73,15.99) 39.91,15.92 40.01,15.82 arc(40.08,15.64) 40.01,15.46 arc(39.93,15.27) 40.01,15.09 40.66,14.44 40.66,13.86 v1(40.78,13.73)
ESP_USB_D-: length 15.5
  Top Layer w0.254: D3.3 39.32,13.05 v1(40,13.73)
  Top Layer w0.29: v2(36.85,23.21) 36.85,23.43 36.62,23.66 36.21,23.66
  Bottom Layer w0.254: v2(36.85,23.21) 36.39,23.21 36.26,23.09 35.88,23.09 35.49,22.7 35.49,22.15 35.88,21.76 36.58,21.76 36.76,21.58 36.76,17.77 40,14.53 v1(40,13.73)
FB: length 5.1
  Top Layer w0.254: R3.1 22.6,14.14
  Top Layer w0.29: R3.1 22.6,13.27 R5.2 21.1,11.11 20.28,10.29 U1.8
HALDEX_CANH: length 21.3
  Top Layer w0.254: 13.45,26.58 13.45,27.58 13.66,27.8 14.19,27.8 14.35,27.96 14.35,32.19 14.78,32.62 16.79,32.62 16.79,32.15 17.15,31.79 18.8,31.79 19.05,32.05 19.05,33.7 19.23,33.88 19.85,33.88 ; 13.45,26.58 v1(11.67,26.58) ; 13.45,26.58 13.69,26.58 13.7,26.57 ; 13.45,26.58 D10.1
  Bottom Layer w0.254: P1.6 10.63,28.99 12.17,28.99 12.5,28.66 12.5,28.27 11.96,27.74 11.96,27.25 11.67,26.96 v1(11.67,26.58)
HALDEX_CANL: length 21.3
  Top Layer w0.254: 13.45,28.47 13.7,28.47 ; 13.45,28.47 13.38,28.41 v1(11.67,28.41) ; 13.45,28.47 13.45,28.98 13.94,29.48 NOREF#38.TP13 13.94,33.8 15.96,35.82 R24.1 16.78,36.25 17.15,36.62 18.8,36.62 19.05,36.36 19.05,34.71 19.23,34.53 U11.6 ; 13.45,28.47 D10.2
  Bottom Layer w0.254: v1(11.67,28.41) 11.67,28.02 11.56,27.91 11.56,27.9 11.18,27.52 9.82,27.52 9.53,27.23 9.53,26.63 9.91,26.25 P1.5
HB_IN: length 27.2
  Top Layer w0.2: v1(8.76,27.35) 8.76,26.13 9.76,25.13 12.9,25.13 13.08,25.31 v1(13.08,25.44)
  Top Layer w0.29: R9.2 23.25,23.67 v1(23.24,23.66)
  Top Layer w0.35: 5.73,23.3 6.94,23.3 P1.10
  Bottom Layer w0.29: v1(13.08,25.44) 13.3,25.66 22.51,25.66 23.24,24.93 v1(23.24,23.66) ; v1(8.76,27.35) 6.73,27.35 5.97,26.58 5.97,25.17 P1.10
HB_OUT: length 17.1
  Top Layer w0.35: P1.11 6.02,26.25 4.43,24.67 4.43,23.3
  Bottom Layer w0.559: P1.11 8.1,26.25 9.37,24.98 12.4,24.98 13.65,23.73 13.65,22.58 15.36,20.87 16.6,20.87
  vias: v1(15.93,20.93) v1(16.79,20.91)
MTCK: length 25
  Top Layer w0.29: H1.2 39.75,39.11 39.75,36.54 40.37,35.92 40.37,35.28 ; 40.27,24.9 40.86,24.9 41.28,25.31 v1(41.28,27.44)
  Bottom Layer w0.29: 38.84,40.41 38.21,40.41 37.08,39.28 37.08,36.87 38.61,35.35 38.61,30.52 41.28,27.86 v1(41.28,27.44)
MTDI: length 10.9
  Top Layer w0.29: D8.5 v1(41.02,32.62) ; U9.10 v1(41.94,29.38)
  Bottom Layer w0.29: 41.38,37.87 41.02,37.52 v1(41.02,32.62) 41.02,30.01 41.66,29.38 v1(41.94,29.38)
MTDO: length 25.4
  Top Layer w0.29: D8.1 41.94,35.28 42.22,35.57 42.22,39.18 H1.4 ; v1(42.04,27.45) 42.04,24.94 41.2,24.1 40.27,24.1
  Bottom Layer w0.29: 41.38,40.41 39.55,38.59 39.55,30.59 42.04,28.11 v1(42.04,27.45)
MTMS: length 16.8
  Top Layer w0.29: U9.9 v1(42.74,29.38) ; H1.5 42.67,37.01 42.67,35.22 41.67,34.22 D8.6
  Bottom Layer w0.29: 43.91,37.87 43.56,37.52 43.56,35.86 44.58,34.84 44.58,30.01 43.94,29.38 v1(42.74,29.38)
RESET: length 25
  Top Layer w0.29: 38.48,37.25 38.48,32.94 40.83,30.58 43.73,30.58 43.78,30.53 ; 38.48,37.25 39.5,36.24 39.5,34.97 40.37,34.09 40.37,33.38 ; 38.48,37.25 38.45,37.28 H1.1 ; 38.48,37.25 38.48,37.87 H1.1 ; R27.1 43.54,30.52 U9.8 ; H1.1 37.45,37.87 35.27,35.69 SW2.2
RGB_LED: length 37.1
  Top Layer w0.29: 40.27,19.3 38.69,19.3 38.44,19.05 R17.1
  Bottom Layer w0.29: LED2.4 16.47,40.09 17.02,39.54 21.97,39.54 39.62,21.89 39.62,19.99 v1(38.93,19.3)
RT: length 1.8
  Top Layer w0.29: R4.2 18.86,10.9 19,10.76 U1.1
SS: length 1.8
  Top Layer w0.29: C9.2 21.51,10.13 20.84,9.45 U1.7
SW: length 1.6
  Top Layer w0.443: C1.1 23.11,6.77
SWITCH_MODE: length 30.1
  Top Layer w0.254: SW1.4 33.41,40.15 35.66,40.15
  Top Layer w0.29: U9.25 v1(41.14,17.69)
  Bottom Layer w0.254: SW1.4 32.08,30.2 41.14,21.14 v1(41.14,17.69)
SWITCH_MODE_EXT: length 34.5
  Top Layer w0.254: R11.2 23.25,17.44
  Top Layer w0.29: R11.2 23.21,16.46 v1(22.46,16.46)
  Top Layer w0.35: P1.7 4.43,19.21 4.43,21.49
  Bottom Layer w0.29: v1(22.46,16.46) 22.46,15.55 21.8,14.89 18.32,14.89 17.63,14.2 17.63,9.09 17.27,8.74 12.71,8.74 7.39,14.05 P1.7
USB_D+: length 5.2
  Top Layer w0.254: USB1.6 39.77,6.76 40.02,6.51 40.5,6.51 40.77,6.77 USB1.8 40.77,8.49 41.22,8.94 D3.6
USB_D-: length 5.2
  Top Layer w0.254: 40.27,8.03 40.27,8.75 40.14,8.88 39.46,8.88 39.32,9.02 D3.4 ; 40.27,8.03 USB1.7 ; 40.27,8.03 40.08,8.22 39.36,8.22 39.27,8.13 USB1.5
$2N1005: length 2.2
  Top Layer w0.254: 10.92,4.36 10.88,4.4 LED1.2
$3N1132: length 4.2
  Top Layer w0.29: U7.2 NOREF#9.TP8 R9.1
$3N1135: length 4.3
  Top Layer w0.29: 29.07,20.51 28.85,20.51 28.83,20.49 NOREF#11.TP7 R8.1
$3N1142: length 4.2
  Top Layer w0.29: U8.2 NOREF#40.TP9 R11.1
$3N1660: length 3.1
  Top Layer w0.254: 18.18,21.08 18.18,22.73 18.13,22.78 19.57,22.78
$3N2481: length 4.9
  Top Layer w0.254: NOREF#6.TP15 19.35,23.92 20.7,23.92 21.07,23.55 21.07,21.89 21.63,21.34 Q2.3
$3N2546: length 2.5
  Top Layer w0.254: R12.1 21.1,17.94 20.83,18.2 20.83,18.53 20.39,18.97 20.25,18.97 20.07,19.14 20.07,19.43 20.03,19.47
$3N2561: length 5.7
  Top Layer w0.254: 18.18,19.78 18.61,19.78 19.3,19.09 19.3,18.33 19.7,17.94 R12.2 20.06,16.44 20.05,16.42 NOREF#33.TP16
$4N2100: length 3.2
  Top Layer w0.29: R24.2 18.28,32.63 R22.1
$4N2133: length 3.2
  Top Layer w0.29: 18.27,25.97 C19.2 R23.2

## Copper pours and planes (outline as drawn; the poured copper is in the pictures)
+3.3V on Top Layer: 30.1,3.6 31.75,3.6 31.88,3.72 31.88,6.41 32.28,6.9 33.94,6.9 34.29,7.25 34.29,11.73 33.78,12.23 25.53,12.23 25.15,11.85 25.15,9.19 25.27,9.06 27.4,9.06 27.64,8.82 27.64,6.91 29.46,6.91 29.97,6.39 29.97,3.72
+3.3V on Top Layer: 46.86,37.64 46.87,37.75 46.92,37.88 47.01,38 47.12,38.08 47.26,38.13 47.36,38.14 47.75,38.14 47.85,38.13 47.99,38.08 48.1,38 48.19,37.88 48.24,37.75 48.25,37.64 48.25,29.77 48.24,29.66 48.19,29.53 48.1,29.41 47.99,29.33 47.85,29.28 47.75,29.27 47.36,29.27 47.26,29.28 47.12,29.33 47.01,29.41 46.92,29.53 46.87,29.66 46.86,29.77
+3.3V on Bottom Layer: 27.56,11.73 27.57,11.84 27.62,11.97 27.71,12.09 27.82,12.17 27.95,12.22 28.06,12.23 33.79,12.23 33.89,12.22 34.03,12.17 34.14,12.09 34.23,11.97 34.28,11.84 34.29,11.73 34.29,7.41 34.28,7.3 34.23,7.17 34.14,7.06 34.03,6.97 33.89,6.92 33.79,6.91 28.06,6.91 27.95,6.92 27.82,6.97 27.71,7.06 27.62,7.17 27.57,7.3 27.56,7.41
+3.3V on PWR: 30.12,33.72 30.02,33.73 29.88,33.78 29.77,33.87 29.69,33.98 29.64,34.11 29.62,34.22 29.62,36.98 29.64,37.09 29.69,37.22 29.77,37.34 29.88,37.42 30.02,37.47 30.12,37.48 47.73,37.48 47.83,37.47 47.97,37.42 48.08,37.34 48.17,37.22 48.22,37.09 48.23,36.98 48.23,34.22 48.22,34.11 48.17,33.98 48.08,33.87 47.97,33.78 47.83,33.73 47.73,33.72
+3.3V on PWR: 27.56,11.73 27.57,11.84 27.62,11.97 27.71,12.09 27.82,12.17 27.95,12.22 28.06,12.23 33.79,12.23 33.89,12.22 34.03,12.17 34.14,12.09 34.23,11.97 34.28,11.84 34.29,11.73 34.29,7.41 34.28,7.3 34.23,7.17 34.14,7.06 34.03,6.97 33.89,6.92 33.79,6.91 28.06,6.91 27.95,6.92 27.82,6.97 27.71,7.06 27.62,7.17 27.57,7.3 27.56,7.41
+3.3V on PWR: 29.61,42.01 29.63,42.12 29.68,42.25 29.76,42.36 29.87,42.45 30.01,42.5 30.11,42.51 32.11,42.51 32.22,42.5 32.35,42.45 32.47,42.36 32.55,42.25 32.6,42.12 32.61,42.01 32.61,10.49 32.6,10.38 32.55,10.25 32.47,10.14 32.35,10.05 32.22,10 32.11,9.99 30.11,9.99 30.01,10 29.87,10.05 29.76,10.14 29.68,10.25 29.63,10.38 29.61,10.49
+3.3V on PWR: 17.55,42 17.56,42.11 17.61,42.24 17.7,42.36 17.81,42.44 17.94,42.49 18.05,42.5 20.05,42.5 20.16,42.49 20.29,42.44 20.4,42.36 20.49,42.24 20.54,42.11 20.55,42 20.55,30.63 20.54,30.52 20.49,30.39 20.4,30.27 20.29,30.19 20.16,30.14 20.05,30.13 18.05,30.13 17.94,30.14 17.81,30.19 17.7,30.27 17.61,30.39 17.56,30.52 17.55,30.63
+3.3V on PWR: 19.05,38.18 18.95,38.19 18.81,38.24 18.7,38.33 18.61,38.44 18.56,38.57 18.55,38.68 18.55,42 18.56,42.1 18.61,42.24 18.7,42.35 18.81,42.44 18.95,42.49 19.05,42.5 31.45,42.5 31.55,42.49 31.69,42.44 31.8,42.35 31.89,42.24 31.94,42.1 31.95,42 31.95,38.68 31.94,38.57 31.89,38.44 31.8,38.33 31.69,38.24 31.55,38.19 31.45,38.18
+3.3V on PWR: 25.64,9.24 25.54,9.25 25.4,9.3 25.29,9.38 25.2,9.5 25.15,9.63 25.14,9.74 25.14,11.74 25.15,11.84 25.2,11.98 25.29,12.09 25.4,12.18 25.54,12.23 25.64,12.24 33.72,12.24 33.83,12.23 33.96,12.18 34.07,12.09 34.16,11.98 34.21,11.84 34.22,11.74 34.22,9.74 34.21,9.63 34.16,9.5 34.07,9.38 33.96,9.3 33.83,9.25 33.72,9.24
+3.3V on GND: 27.56,11.73 27.57,11.84 27.62,11.97 27.71,12.09 27.82,12.17 27.95,12.22 28.06,12.23 33.79,12.23 33.89,12.22 34.03,12.17 34.14,12.09 34.23,11.97 34.28,11.84 34.29,11.73 34.29,7.41 34.28,7.3 34.23,7.17 34.14,7.06 34.03,6.97 33.89,6.92 33.79,6.91 28.06,6.91 27.95,6.92 27.82,6.97 27.71,7.06 27.62,7.17 27.57,7.3 27.56,7.41
+5V on Top Layer: 24.76,1.69 24.76,0.42 25.02,0.17 34.16,0.17 34.54,0.55 34.54,6.01 33.91,6.65 32.72,6.65 32.13,6.22 32.13,1.57 31.93,1.3 26.43,1.3 26.03,1.69
+5V on Top Layer: 45.59,13.77 45.6,13.87 45.65,14.01 45.74,14.12 45.85,14.2 45.99,14.25 46.09,14.27 47.63,14.27 47.74,14.25 47.87,14.2 47.99,14.12 48.07,14.01 48.12,13.87 48.13,13.77 48.13,10.83 48.12,10.72 48.07,10.59 47.99,10.47 47.87,10.39 47.74,10.34 47.63,10.33 46.09,10.33 45.99,10.34 45.85,10.39 45.74,10.47 45.65,10.59 45.6,10.72 45.59,10.83
+5V on Bottom Layer: 45.21,13.75 45.84,13.75 46.58,13.01 46.58,5.48 44.6,3.51 43.54,3.51 43.54,0.14 29.26,0.14 29.26,1.41 35.67,1.41 40.02,5.76 44.36,5.76 45.21,6.6
GND on Top Layer: -1.4,45.51 52.45,45.51 52.45,-0.34 -1.4,-0.34
GND on Bottom Layer: -2.13,46.19 54.69,46.19 54.69,-2.9 -2.13,-2.9
GND on PWR: -0.76,45.38 52.2,45.38 52.2,-0.85 -0.76,-0.85
GND on GND: -3.05,47.67 53.47,47.67 53.47,-1.74 -3.05,-1.74
VBAT on Top Layer: 9.53,17.12 13.31,17.12 13.59,16.84 13.59,15.89 13.87,15.6 15.81,15.6 15.88,15.54 15.88,13.25 15.75,13.12 14.22,13.12 13.97,13.38 13.97,14.14 9.53,14.14
VBAT_UF on Top Layer: 16.03,12.84 16,12.87 13.97,12.87 13.72,13.12 13.72,13.63 11.05,13.63 11.05,10.96 11.18,10.84 16,10.84 16.03,10.87
VBUS on Top Layer: 46.63,5.85 45.72,6.29 45.72,9.82 46.01,10.12 48.35,10.12 48.64,9.82 48.64,8.06 48.35,8.06 48.13,7.84 48.13,6.47
VCC on Top Layer: 17.76,20.17 18.63,20.17 18.78,20.01 19.43,20.01 19.45,19.99 19.45,20.8 19.22,21.03 18.77,21.03 18.63,20.89 18.63,20.7 17.76,20.7
VCC on Top Layer: 16.35,14.39 16.35,10.55 16,10.2 13.34,10.2 12.32,9.19 12.32,7.53 12.57,7.28 16.17,7.28 16.68,7.79 18.06,7.79 18.35,8.08 18.35,8.48 18.54,8.68 19.3,8.68 19.43,8.81 19.43,9.17 19.42,9.18 18.26,9.18 17.67,9.77 17.67,14.31 17.59,14.39
VCC on Top Layer: 17.73,19.35 17.73,18.21 17.99,17.96 18.92,17.96 19.1,18.13 19.1,18.82 18.58,19.35
VCC on Bottom Layer: 16.85,18.39 17.24,18.39 17.68,18.83 17.68,20.04 17.68,20.05 17.68,21.04 17.88,21.23 18.77,21.23 20.19,19.81 20.19,17.65 19.57,17.03 16.74,17.03 16.74,18.39
VCC on Bottom Layer: 15.65,18.4 15.6,10.47 13.16,10.24 13.16,9.05 16.63,9.05 17.14,9.57 17.14,18.4
BRAKE_OUT on Bottom Layer: 14.91,19.5 14.92,19.6 14.97,19.73 15.06,19.85 15.17,19.93 15.3,19.98 15.41,20 16.98,20 17.08,19.98 17.22,19.93 17.33,19.85 17.42,19.73 17.47,19.6 17.48,19.5 17.48,19.22 17.47,19.11 17.42,18.98 17.33,18.86 17.22,18.78 17.08,18.73 16.98,18.72 15.41,18.72 15.3,18.73 15.17,18.78 15.06,18.86 14.97,18.98 14.92,19.11 14.91,19.22
BUCK_OUT on Top Layer: 26.54,1.44 28.67,1.44 28.96,1.69 28.96,3.16 28.71,3.4 26.79,3.4 26.54,3.15
BUCK_OUT on Top Layer: 16.99,4.36 16.99,0.45 17.27,0.17 24.26,0.17 24.51,0.42 24.51,2.67 24.12,3.07 20.47,3.07 19.18,4.36
BUCK_OUT on Bottom Layer: 26.9,3.42 28.71,3.42 28.9,3.23 28.9,0.66 28.55,0.31 18.74,0.31 18.74,2.39 18.96,2.6 25.81,2.6
HB_OUT on Bottom Layer: 14.85,21.13 14.87,21.24 14.92,21.37 15,21.48 15.11,21.57 15.25,21.62 15.35,21.63 16.92,21.63 17.03,21.62 17.16,21.57 17.28,21.48 17.36,21.37 17.41,21.24 17.42,21.13 17.42,20.78 17.41,20.67 17.36,20.54 17.28,20.42 17.16,20.34 17.03,20.29 16.92,20.28 15.35,20.28 15.25,20.29 15.11,20.34 15,20.42 14.92,20.54 14.87,20.67 14.85,20.78
SW on Top Layer: 19.93,5.34 20.44,4.83 23.65,4.83 23.83,5.01 23.83,6.89 23.15,7.57 21.06,7.57 20.75,7.88 20.75,8.58 20.72,8.61 19.93,8.61

## Text on the board
Bottom Silkscreen Layer: github.com/ / adamforbes92/ / OpenHaldex-C6 | C6 V1.0 | OpenHaldex | Designed by: | Adam Forbes | Arwid Vasilev
Top Silkscreen Layer: VCC | RST | CK | JTAG Debug | DO | DI | GND | MS | 3.3V | 5V | VBUS | PWR | BOOT | Mode / LED | Mode / Switch | OpenHaldex | V1.2 | C6
